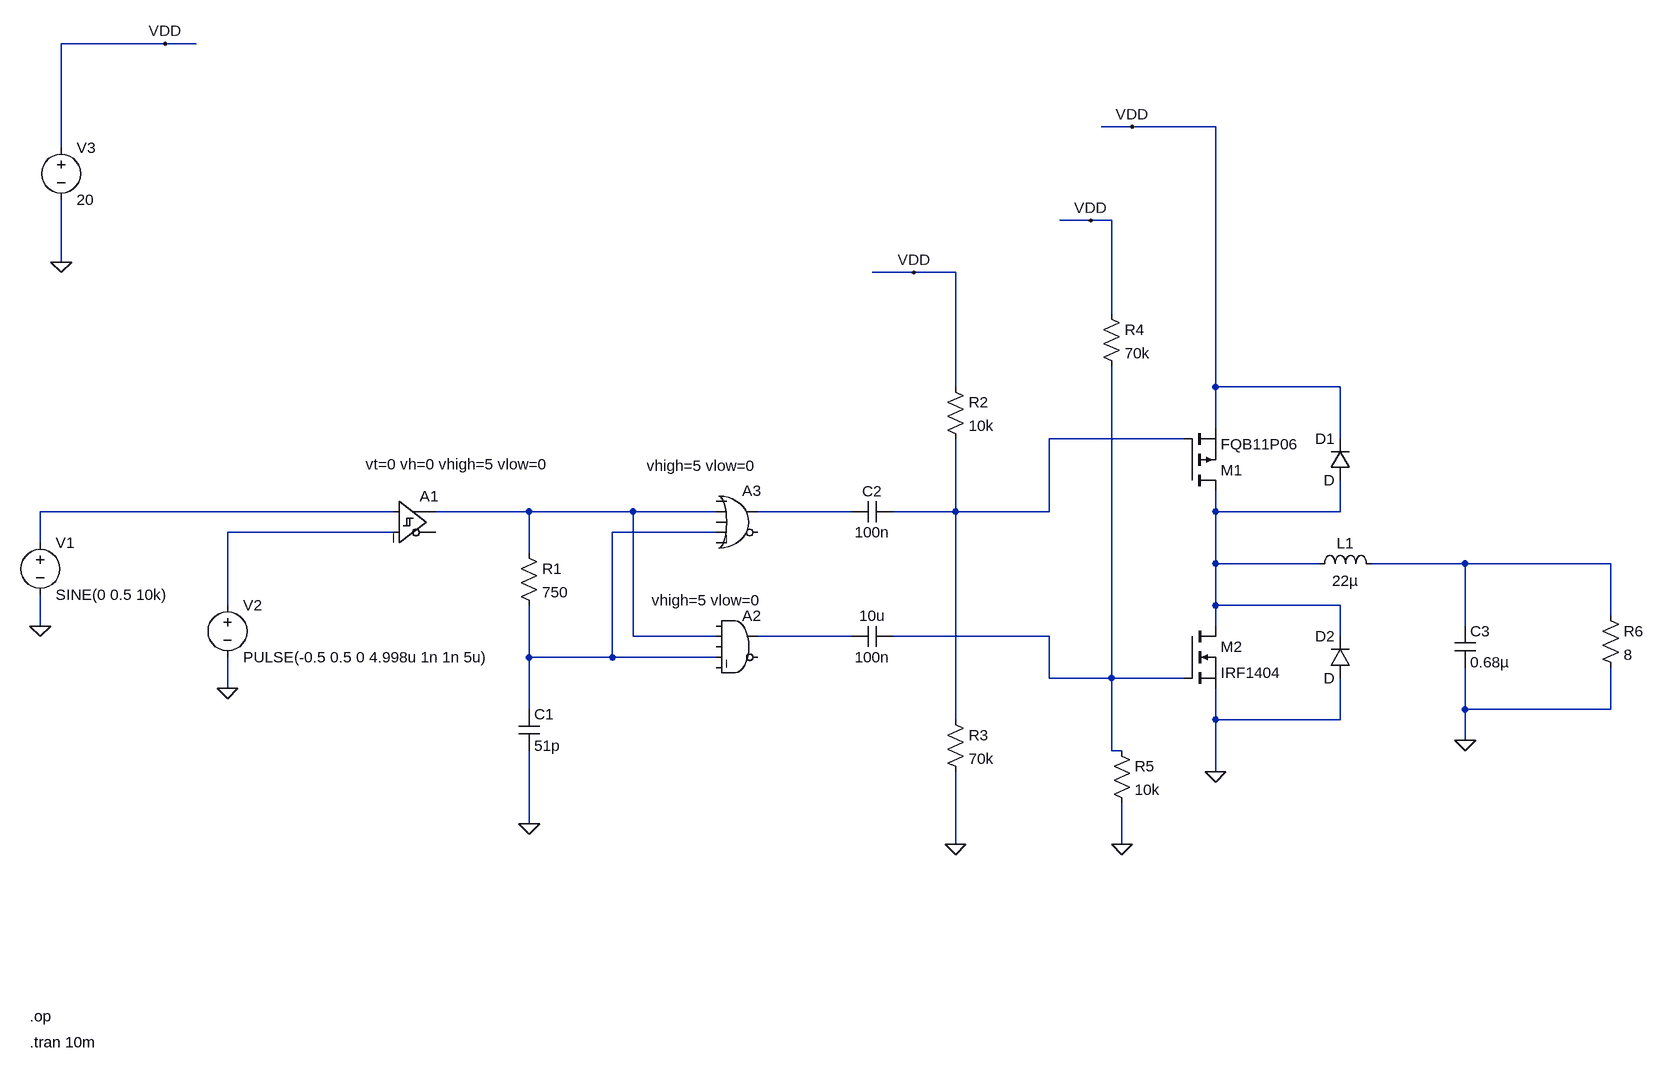
[diagram p0: schematic ClassDAmplifierHalfBridgeSimulation.asc]
ClassDAmplifierHalfBridgeSimulation.asc, the LTspice schematic file:
Version 4
SHEET 1 4836 1168
WIRE -176 -656 -336 -656
WIRE -128 -656 -176 -656
WIRE 1312 -528 1264 -528
WIRE 1440 -528 1312 -528
WIRE -336 -496 -336 -656
WIRE 1248 -384 1200 -384
WIRE 1280 -384 1248 -384
WIRE -336 -320 -336 -416
WIRE 976 -304 912 -304
WIRE 1040 -304 976 -304
WIRE 1280 -240 1280 -384
WIRE 1040 -128 1040 -304
WIRE 1440 -128 1440 -528
WIRE 1632 -128 1440 -128
WIRE 1440 -64 1440 -128
WIRE 1392 -48 1184 -48
WIRE 1632 -48 1632 -128
WIRE 176 64 -368 64
WIRE 384 64 240 64
WIRE 544 64 384 64
WIRE 672 64 544 64
WIRE 880 64 736 64
WIRE 1040 64 1040 -48
WIRE 1040 64 944 64
WIRE 1184 64 1184 -48
WIRE 1184 64 1040 64
WIRE 1440 64 1440 32
WIRE 1632 64 1632 16
WIRE 1632 64 1440 64
WIRE 176 96 -80 96
WIRE 672 96 512 96
WIRE -368 112 -368 64
WIRE 384 128 384 64
WIRE 1440 144 1440 64
WIRE 1600 144 1440 144
WIRE 1824 144 1680 144
WIRE 2048 144 1824 144
WIRE -80 208 -80 96
WIRE 1440 208 1440 144
WIRE 1632 208 1440 208
WIRE 2048 224 2048 144
WIRE -368 240 -368 192
WIRE 1440 240 1440 208
WIRE 1824 240 1824 144
WIRE 544 256 544 64
WIRE 672 256 544 256
WIRE 880 256 736 256
WIRE 1184 256 944 256
WIRE 1632 256 1632 208
WIRE 384 288 384 208
WIRE 512 288 512 96
WIRE 512 288 384 288
WIRE 672 288 512 288
WIRE 1184 320 1184 256
WIRE 1280 320 1280 -160
WIRE 1280 320 1184 320
WIRE 1392 320 1280 320
WIRE -80 336 -80 288
WIRE 384 368 384 288
WIRE 1824 368 1824 304
WIRE 2048 368 2048 304
WIRE 2048 368 1824 368
WIRE 1040 384 1040 64
WIRE 1440 384 1440 336
WIRE 1632 384 1632 320
WIRE 1632 384 1440 384
WIRE 1824 416 1824 368
WIRE 1280 432 1280 320
WIRE 1296 432 1280 432
WIRE 1440 464 1440 384
WIRE 384 544 384 432
WIRE 1040 576 1040 464
WIRE 1296 576 1296 512
FLAG -80 336 0
FLAG -368 240 0
FLAG 384 544 0
FLAG -336 -320 0
FLAG -176 -656 VDD
FLAG 1440 464 0
FLAG 1312 -528 VDD
FLAG 1296 576 0
FLAG 1040 576 0
FLAG 976 -304 VDD
FLAG 1248 -384 VDD
FLAG 1824 416 0
SYMBOL Digital\\diffschmitt 176 16 R0
WINDOW 3 -43 -25 Left 2
SYMATTR Value vt=0 vh=0 vhigh=5 vlow=0
SYMATTR InstName A1
SYMBOL voltage -368 96 R0
WINDOW 123 0 0 Left 0
WINDOW 39 0 0 Left 0
SYMATTR InstName V1
SYMATTR Value SINE(0 0.5 10k)
SYMBOL voltage -80 192 R0
WINDOW 123 0 0 Left 0
WINDOW 39 0 0 Left 0
SYMATTR InstName V2
SYMATTR Value PULSE(-0.5 0.5 0 4.998u 1n 1n 5u)
SYMBOL Digital\\and 704 208 R0
WINDOW 3 -131 -8 Left 2
SYMATTR Value vhigh=5 vlow=0
SYMATTR InstName A2
SYMBOL Digital\\or 704 16 R0
WINDOW 3 -139 -23 Left 2
SYMATTR Value vhigh=5 vlow=0
SYMATTR InstName A3
SYMBOL res 368 112 R0
SYMATTR InstName R1
SYMATTR Value 750
SYMBOL cap 368 368 R0
SYMATTR InstName C1
SYMATTR Value 51p
SYMBOL voltage -336 -512 R0
WINDOW 123 0 0 Left 0
WINDOW 39 0 0 Left 0
SYMATTR InstName V3
SYMATTR Value 20
SYMBOL cap 944 48 R90
WINDOW 0 0 32 VBottom 2
WINDOW 3 32 32 VTop 2
SYMATTR InstName C2
SYMATTR Value 100n
SYMBOL cap 944 240 R90
WINDOW 0 0 32 VBottom 2
WINDOW 3 32 32 VTop 2
SYMATTR InstName 10u
SYMATTR Value 100n
SYMBOL pmos 1392 32 M180
SYMATTR InstName M1
SYMATTR Value FQB11P06
SYMBOL nmos 1392 240 R0
SYMATTR InstName M2
SYMATTR Value IRF1404
SYMBOL res 1024 -144 R0
SYMATTR InstName R2
SYMATTR Value 10k
SYMBOL res 1024 368 R0
SYMATTR InstName R3
SYMATTR Value 70k
SYMBOL res 1264 -256 R0
SYMATTR InstName R4
SYMATTR Value 70k
SYMBOL res 1280 416 R0
SYMATTR InstName R5
SYMATTR Value 10k
SYMBOL ind 1584 160 R270
WINDOW 0 32 56 VTop 2
WINDOW 3 5 56 VBottom 2
SYMATTR InstName L1
SYMATTR Value 22µ
SYMBOL cap 1808 240 R0
SYMATTR InstName C3
SYMATTR Value 0.68µ
SYMBOL res 2032 208 R0
SYMATTR InstName R6
SYMATTR Value 8
SYMBOL diode 1648 16 R180
WINDOW 0 24 64 Left 2
WINDOW 3 24 0 Left 2
SYMATTR InstName D1
SYMBOL diode 1648 320 R180
WINDOW 0 24 64 Left 2
WINDOW 3 24 0 Left 2
SYMATTR InstName D2
TEXT -384 840 Left 2 !.op
TEXT -384 880 Left 2 !.tran 10m

The netlist it stands for:
* ClassDAmplifierHalfBridgeSimulation.asc
A1 N002 N006 0 0 0 0 N003 0 SCHMITT vt=0 vh=0 vhigh=5 vlow=0
V1 N002 0 SINE(0 0.5 10k)
V2 N006 0 PULSE(-0.5 0.5 0 4.998u 1n 1n 5u)
A2 0 N003 0 N007 0 0 N009 0 AND vhigh=5 vlow=0
A3 0 N003 0 N007 0 0 N004 0 OR vhigh=5 vlow=0
R1 N003 N007 750
C1 N007 0 51p
V3 VDD 0 20
C2 N001 N004 100n
C§10u N010 N009 100n
M1 N005 N001 VDD VDD FQB11P06
M2 N005 N010 0 0 IRF1404
R2 VDD N001 10k
R3 N001 0 70k
R4 VDD N010 70k
R5 N010 0 10k
L1 N005 N008 22µ
C3 N008 0 0.68µ
R6 N008 0 8
D1 N005 VDD D
D2 0 N005 D
.model D D
.lib standard.dio
.model NMOS NMOS
.model PMOS PMOS
.lib standard.mos
.op
.tran 10m
.backanno
.end